# EAGLE design s2k_kpro (EAGLE 7.6.0)

## Sheet 1 of 2: Processor and Digital Interfaces
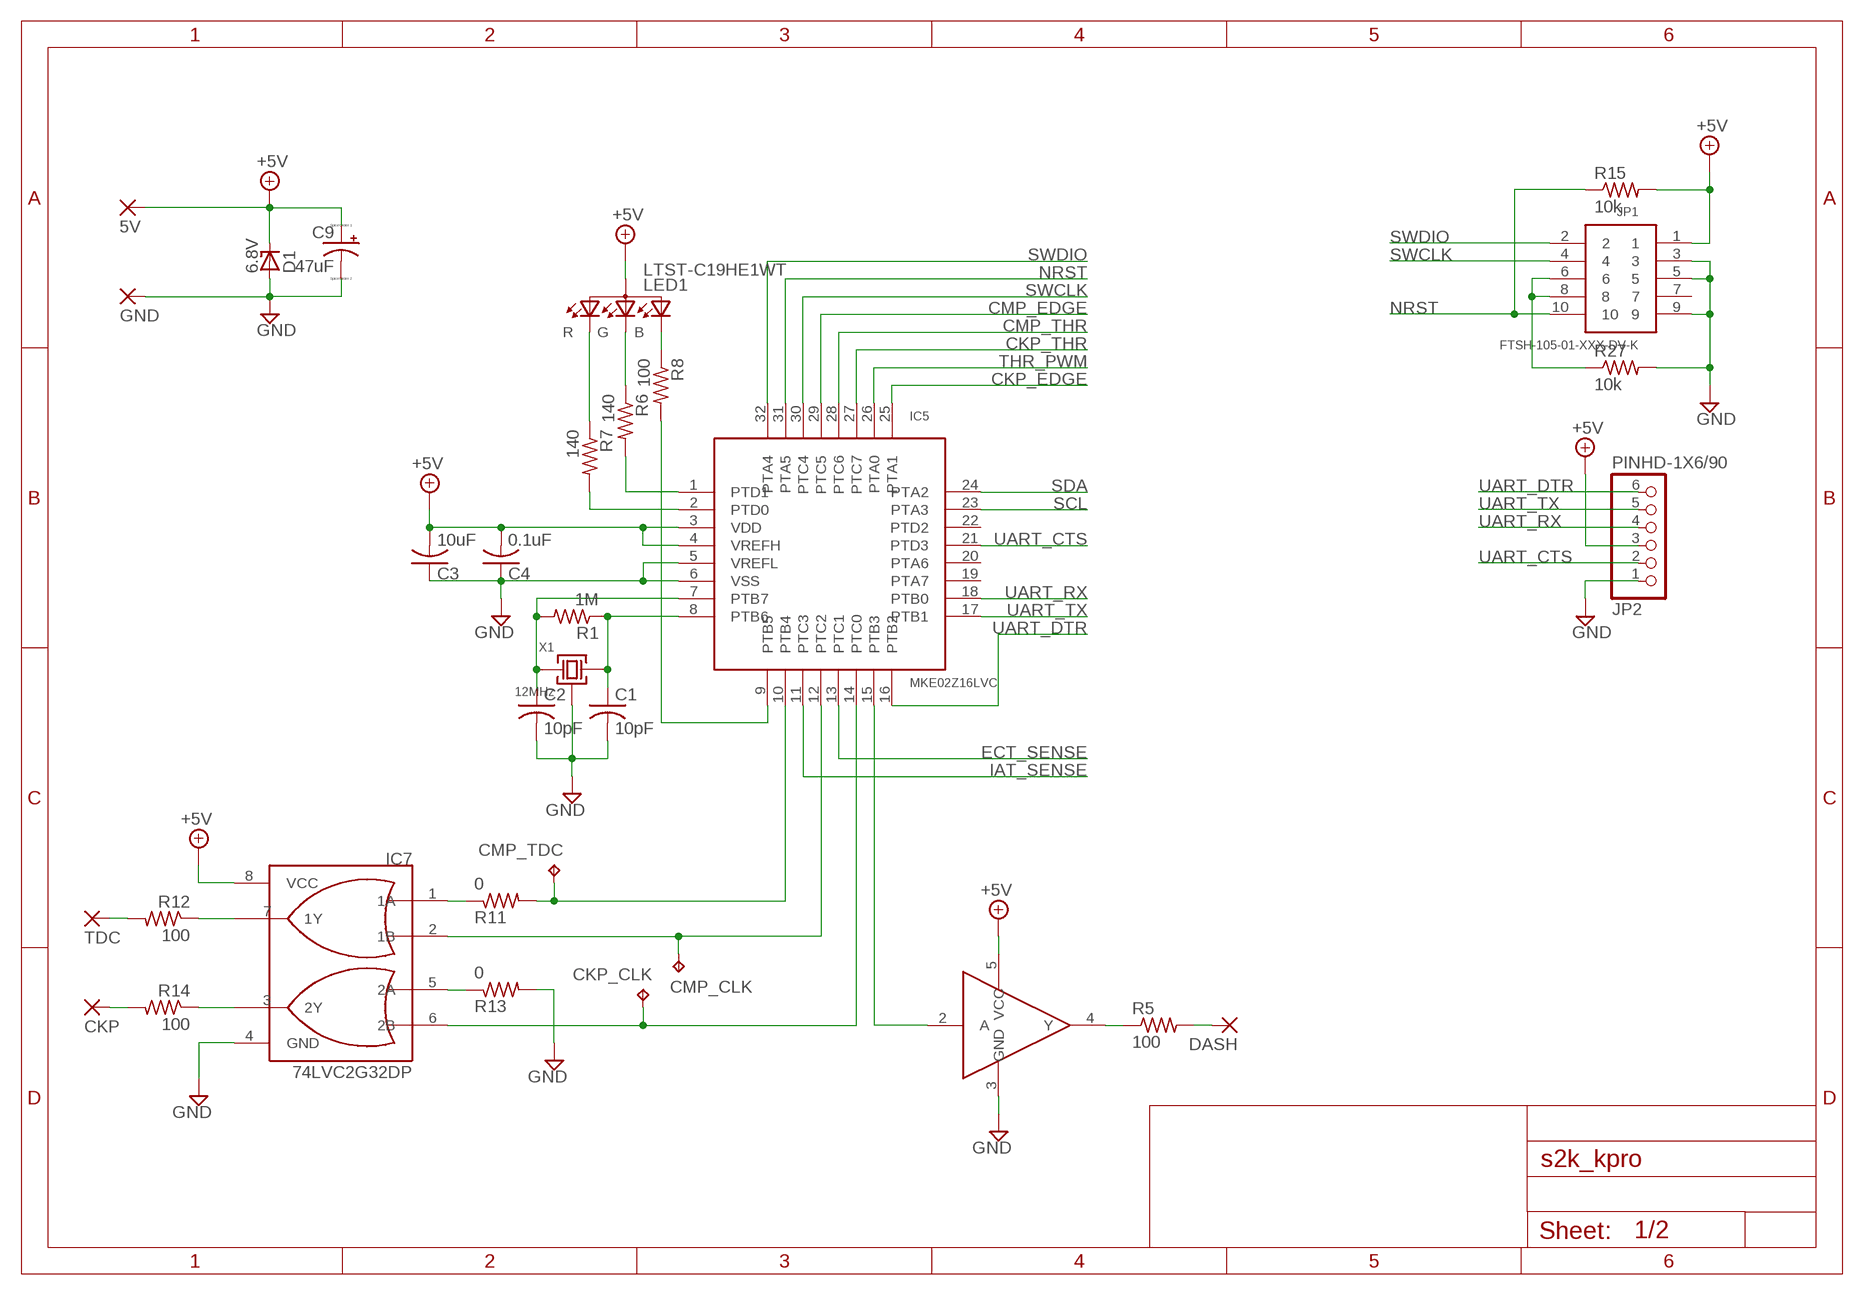
[diagram p0: schematic, sheet 1]

### Parts
5V  5V  SIGPAD-P1-20  [P1-20]
C1  10pF  C-USC0603  [C0603]
C2  10pF  C-USC0603  [C0603]
C3  10uF  C-USC0805  [C0805]
C4  0.1uF  C-USC0603  [C0603]
C9  47uF  CPOL-USD/7343-31R  [D/7343-31R]
CKP  SIGPAD-P1-20  [P1-20]
CKP_CLK  TPB2,54  [B2,54]
CMP_CLK  TPB2,54  [B2,54]
CMP_TDC  TPB2,54  [B2,54]
D1  6.8V  ZENER-DIODESOT23  [SOT23]
DASH  SIGPAD-P1-20  [P1-20]
GND  SIGPAD-P1-20  [P1-20]
IC5  MKE02Z16LVC  [LQFP32-7X7]
IC6  74LVC1G17SE  [SOT353]
IC7  74LVC2G32DP  [TSSOP8]
JP1  FTSH-105-01-XXX-DV-K  [FTSH-105-01-XXX-DV-K]
JP2  PINHD-1X6/90  [1X06/90]
LED1  LTST-C19HE1WT  [LED-0606]
R1  1M  R-US_R0603  [R0603]
R5  100  R-US_R0603  [R0603]
R6  140  R-US_R0603  [R0603]
R7  140  R-US_R0603  [R0603]
R8  100  R-US_R0603  [R0603]
R11  0  R-US_R0603  [R0603]
R12  100  R-US_R0603  [R0603]
R13  0  R-US_R0603  [R0603]
R14  100  R-US_R0603  [R0603]
R15  10k  R-US_R0603  [R0603]
R27  10k  R-US_R0603  [R0603]
TDC  SIGPAD-P1-20  [P1-20]
X1  12MHz  CX2520DB  [SMD4-2520]

### Nets
+5V: 5V.TP(P) C3.2 C4.2 C9.+ D1.3(C) IC5.3(VDD) IC5.4(VREFH) IC6.5(VCC) IC7.8(VCC) JP1.1 JP2.3 LED1.4(ANODE) R15.2 ; also sheet 2
CAM_CLK: CMP_CLK.TP IC5.12(PTC2) IC7.2(1B)
CAM_OUT: R12.2 TDC.TP(P)
CAM_TDC: CMP_TDC.TP IC5.10(PTB4) R11.2
CKP_CLK: CKP_CLK.TP IC5.14(PTC0) IC7.6(2B)
CKP_EDGE: IC5.25(PTA1) ; also sheet 2
CKP_THR: IC5.27(PTC7) ; also sheet 2
CMP_EDGE: IC5.29(PTC5) ; also sheet 2
CMP_THR: IC5.28(PTC6) ; also sheet 2
CRANK_OUT: CKP.TP(P) R14.2
ECT_OUT: DASH.TP(P) R5.2
ECT_PWM: IC5.15(PTB3) IC6.2(A)
ECT_SENSE: IC5.13(PTC1) ; also sheet 2
EXTAL: C2.1 IC5.7(PTB7) R1.2 X1.3
GND: C1.2 C2.2 C3.1 C4.1 C9.- D1.1(A) GND.TP(P) IC5.5(VREFL) IC5.6(VSS) IC6.3(GND) IC7.4(GND) JP1.3 JP1.5 JP1.9 JP2.1 R13.2 R27.2 X1.2(GND) X1.4(GND) ; also sheet 2
IAT_SENSE: IC5.11(PTC3) ; also sheet 2
LED_B: IC5.9(PTB5) R8.2
LED_G: IC5.2(PTD0) R7.2
LED_R: IC5.1(PTD1) R6.2
N$1: IC7.7(1Y) R12.1
N$6: IC7.1(1A) R11.1
N$9: LED1.2(G) R6.1
N$11: IC7.5(2A) R13.1
N$12: LED1.1(R) R7.1
N$13: LED1.3(B) R8.1
N$14: IC7.3(2Y) R14.1
N$16: IC6.4(Y) R5.1
N$24: JP1.6 JP1.8 R27.1
NRST: IC5.31(PTA5) JP1.10 R15.1 ; also sheet 2
SCL: IC5.23(PTA3) ; also sheet 2
SDA: IC5.24(PTA2) ; also sheet 2
SWCLK: IC5.30(PTC4) JP1.4
SWDIO: IC5.32(PTA4) JP1.2
THR_PWM: IC5.26(PTA0) ; also sheet 2
UART_CTS: IC5.21(PTD3) JP2.2
UART_DTR: IC5.16(PTB2) JP2.6
UART_RX: IC5.18(PTB0) JP2.4
UART_TX: IC5.17(PTB1) JP2.5
XTAL: C1.1 IC5.8(PTB6) R1.1 X1.1
Unconnected: IC5.19(PTA7) IC5.20(PTA6) IC5.22(PTD2) JP1.7

## Sheet 2 of 2: Analog Interfaces
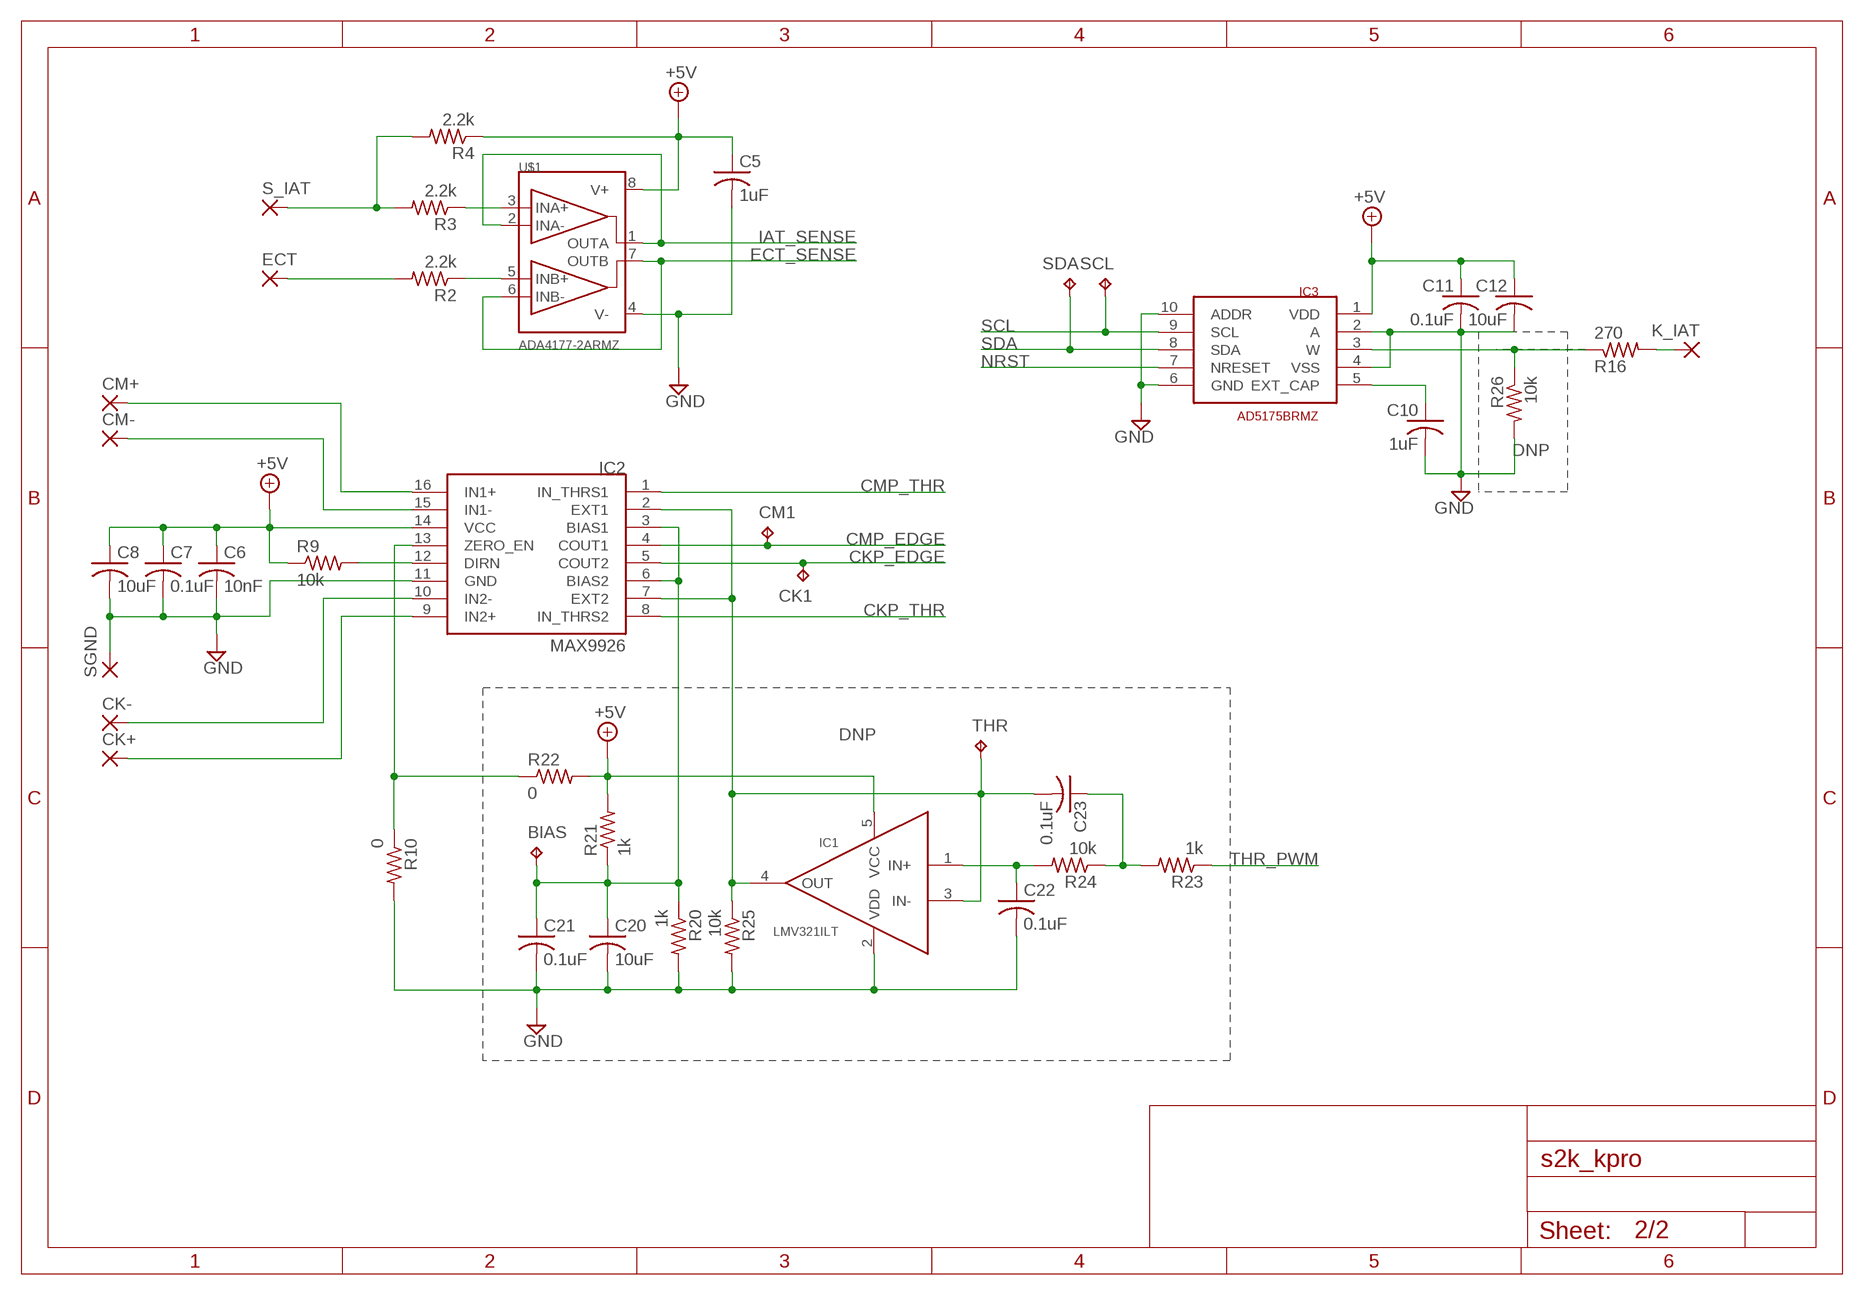
[diagram p1: schematic, sheet 2]

### Parts
BIAS  TPB2,54  [B2,54]
C5  1uF  C-USC0603  [C0603]
C6  10nF  CAP-0306  [C0306]
C7  0.1uF  C-USC0603  [C0603]
C8  10uF  C-USC0805  [C0805]
C10  1uF  C-USC0603  [C0603]
C11  0.1uF  C-USC0603  [C0603]
C12  10uF  C-USC0805  [C0805]
C20  10uF  C-USC0603  [C0603]
C21  0.1uF  C-USC0603  [C0603]
C22  0.1uF  C-USC0603  [C0603]
C23  0.1uF  C-USC0603  [C0603]
CK1  TPB2,54  [B2,54]
CK+  SIGPAD-P1-20  [P1-20]
CK-  SIGPAD-P1-20  [P1-20]
CM1  TPB2,54  [B2,54]
CM+  SIGPAD-P1-20  [P1-20]
CM-  SIGPAD-P1-20  [P1-20]
ECT  SIGPAD-P1-20  [P1-20]
IC1  LMV321ILT  [SOT23-5L]
IC2  MAX9926  [16-QSOP]
IC3  AD5175BRMZ  [MSOP10]
K_IAT  SIGPAD-P1-20  [P1-20]
R2  2.2k  R-US_R0603  [R0603]
R3  2.2k  R-US_R0603  [R0603]
R4  2.2k  R-US_R0603  [R0603]
R9  10k  R-US_R0603  [R0603]
R10  0  R-US_R0603  [R0603]
R16  270  R-US_R0603  [R0603]
R20  1k  R-US_R0603  [R0603]
R21  1k  R-US_R0603  [R0603]
R22  0  R-US_R0603  [R0603]
R23  1k  R-US_R0603  [R0603]
R24  10k  R-US_R0603  [R0603]
R25  10k  R-US_R0603  [R0603]
R26  10k  R-US_R0603  [R0603]
S_IAT  SIGPAD-P1-20  [P1-20]
SCL  TPB2,54  [B2,54]
SDA  TPB2,54  [B2,54]
SGND  SIGPAD-P1-20  [P1-20]
THR  TPB2,54  [B2,54]
U$1  ADA4177-2ARMZ  [MSOP08]

### Nets
+5V: C5.1 C6.1 C7.1 C8.1 C11.1 C12.1 IC1.5(VCC) IC2.14(VCC) IC3.1(VDD) R4.1 R9.1 R21.2 R22.2 U$1.8(V+) ; also sheet 1
CAM_IN+: CM+.TP(P) IC2.16(IN1+)
CAM_IN-: CM-.TP(P) IC2.15(IN1-)
CKP_EDGE: CK1.TP IC2.5(COUT2) ; also sheet 1
CKP_THR: IC2.8(IN_THRS2) ; also sheet 1
CMP_EDGE: CM1.TP IC2.4(COUT1) ; also sheet 1
CMP_THR: IC2.1(IN_THRS1) ; also sheet 1
CRANK_IN+: CK+.TP(P) IC2.9(IN2+)
CRANK_IN-: CK-.TP(P) IC2.10(IN2-)
ECT_SENSE: U$1.6(INB-) U$1.7(OUTB) ; also sheet 1
GND: C5.2 C6.2 C7.2 C8.2 C10.2 C11.2 C12.2 C20.2 C21.2 C22.2 IC1.2(VDD) IC2.11(GND) IC3.2(A) IC3.4(VSS) IC3.6(GND) IC3.10(ADDR) R10.2 R20.2 R25.2 R26.2 SGND.TP(P) U$1.4(V-) ; also sheet 1
IAT_SENSE: U$1.1(OUTA) U$1.2(INA-) ; also sheet 1
N$2: R3.1 U$1.3(INA+)
N$3: R3.2 R4.2 S_IAT.TP(P)
N$4: R2.1 U$1.5(INB+)
N$5: IC2.12(DIRN) R9.2
N$7: ECT.TP(P) R2.2
N$8: C22.1 IC1.1(IN+) R24.2
N$10: IC2.13(ZERO_EN) R10.1 R22.1
N$15: C23.1 R23.2 R24.1
N$18: C23.2 IC1.3(IN-) IC1.4(OUT) IC2.2(EXT1) IC2.7(EXT2) R25.1 THR.TP
N$27: C10.1 IC3.5(EXT_CAP)
N$28: IC3.3(W) R16.1 R26.1
N$29: K_IAT.TP(P) R16.2
NRST: IC3.7(NRESET) ; also sheet 1
SCL: IC3.9(SCL) SCL.TP ; also sheet 1
SDA: IC3.8(SDA) SDA.TP ; also sheet 1
THR_PWM: R23.1 ; also sheet 1
VR_BIAS: BIAS.TP C20.1 C21.1 IC2.3(BIAS1) IC2.6(BIAS2) R20.1 R21.1

### Notes on the sheet
- DNP
- DNP

## Library data of the parts
5V CK+ CK- CKP CM+ CM- DASH ECT GND K_IAT S_IAT SGND TDC = parts:SIGPAD-P1-20: THROUGH-HOLE PAD
BIAS CK1 CKP_CLK CM1 CMP_CLK CMP_TDC SCL SDA THR = testpad:TP: Test pad
C1-C5 C7 C8 C10-C12 C22 C23 = resistor:C-US: CAPACITOR, American symbol
C6 = parts:CAP-0306
C9 = resistor:CPOL-US: POLARIZED CAPACITOR, American symbol
C20 C21 = resistor:C-US: CAPACITOR, American symbol; DNP: DNP
D1 = diode:ZENER-DIODE: Z-Diode
IC1 = parts:LMV321ILT
IC2 = parts:MAX9926
IC3 = parts:AD5175BRMZ
IC5 = parts:MKE02Z16LVC
IC6 = parts:74LVC1G17SE
IC7 = parts:74LVC2G32DP
JP1 = FTSH-105-XX-XX-DV-K:FTSH-105-01-XXX-DV-K
JP2 = parts:PINHD-1X6: PIN HEADER
LED1 = parts:LTST-C19HE1WT
R1-R16 R23 R24 R27 = resistor:R-US_: RESISTOR, American symbol
R20-R22 R25 R26 = resistor:R-US_: RESISTOR, American symbol; DNP: DNP
U$1 = parts:ADA4177-2ARMZ
X1 = parts:CX2520DB

## Board
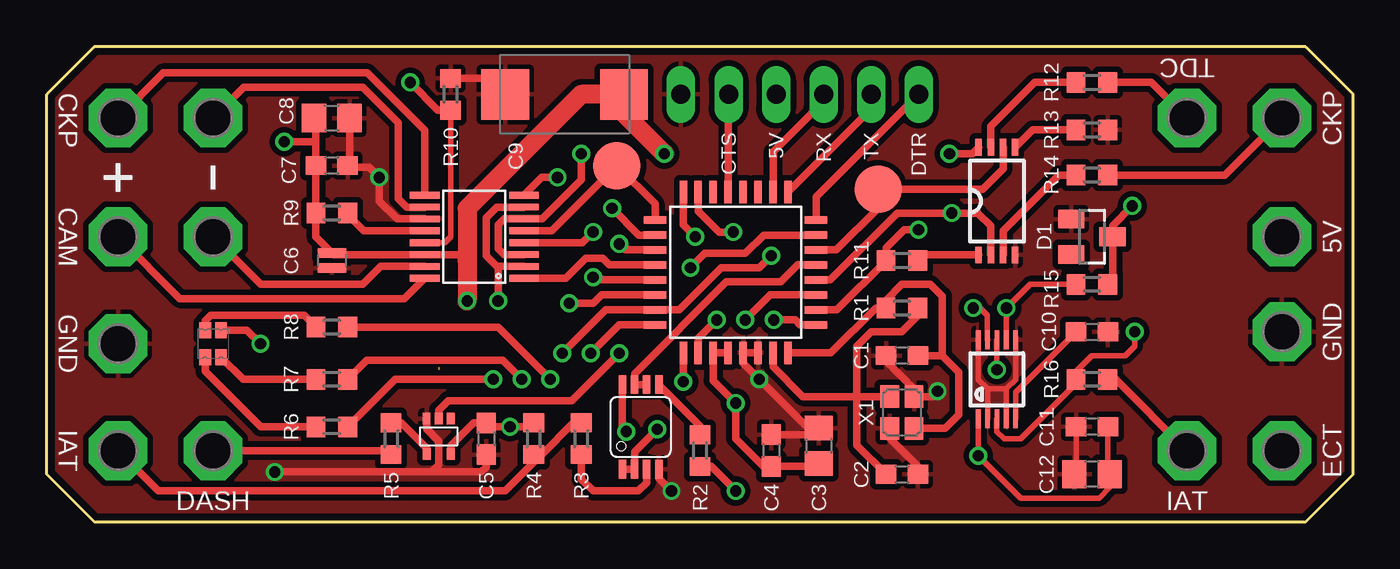
[diagram p2: board, top side]
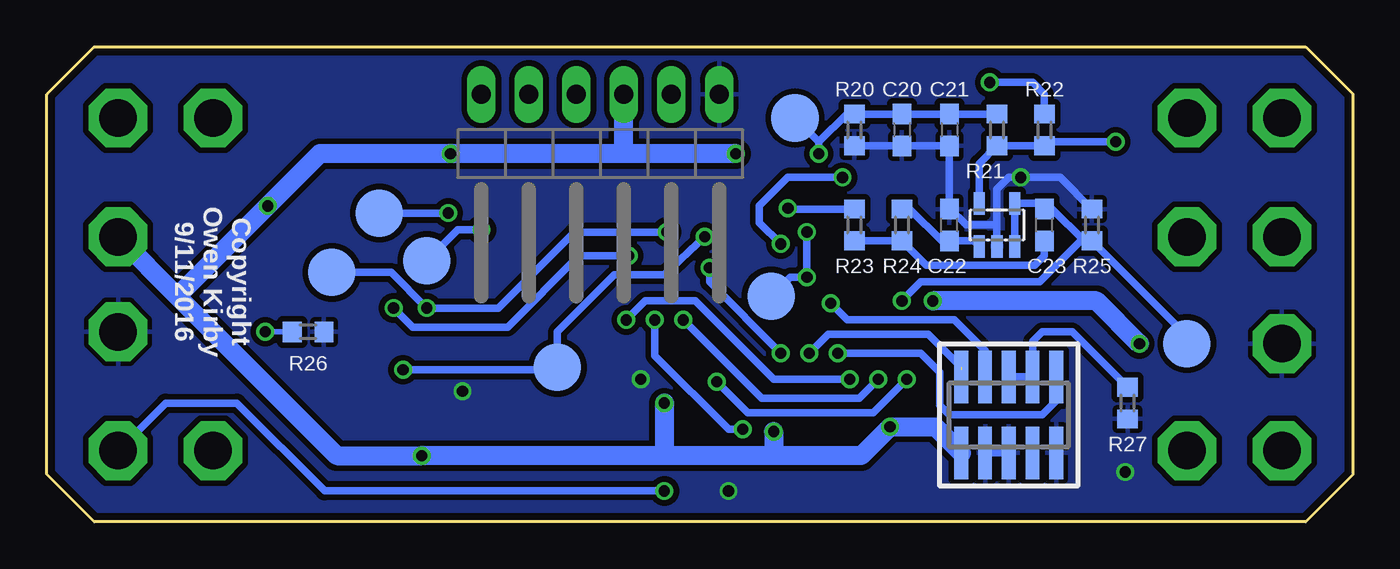
[diagram p3: board, bottom side, seen from below]

Size 69.85 x 25.4 mm. Coordinates in mm from the lower left corner, seen from the top.
Outline: 2.54,0 67.31,0 69.85,2.54 69.85,22.86 67.31,25.4 2.54,25.4 0,22.86 0,2.54 2.54,0
Copper layers (1*16): Top 0.0356mm / dielectric 1.5011mm / Bottom 0.0356mm
Design rules "oshpark-2layer": minimum track width 6mil, minimum drill 13mil, track to track 6mil, track to pad 6mil, pad to pad 6mil, via to via 6mil, smd to smd 6mil, copper to edge 15mil, drill to drill 6mil, minimum pad ring 7mil, minimum via ring 7mil, stop-mask expansion 2.5mil, vias tented up to drill 0mil, thermal gap 10mil

### Footprints (pad centres in the part's own frame; a part is rotated, then mirrored left to right if it is on the bottom)
P1-20 = drill 2.007 pad 3.15 octagon: TP 0,0
B2,54 = smd 2.54 x 2.54: TP 0,0
C0603 = smd 1.1 x 1: 1 -0.85,0; 2 0.85,0
C0805 = smd 1.3 x 1.5: 1 -0.95,0; 2 0.95,0
C0306 = smd 1.52 x 0.51: 1 0,0.41; 2 0,-0.41
D/7343-31R = smd 2.55 x 2.7: + 3.175,0; - -3.175,0
SOT23 = smd 1 x 1.4: 1 -0.95,-1.1; 2 0.95,-1.1; 3 0,1.1
SOT23-5L = smd 0.6 x 1.2: 1 -0.95,-1.15; 2 0,-1.15; 3 0.95,-1.15; 4 0.95,1.15; 5 -0.95,1.15
16-QSOP = smd 1.6 x 0.36: 1 -2.655,2.223; 2 -2.655,1.587; 3 -2.655,0.953; 4 -2.655,0.318; 5 -2.655,-0.318; 6 -2.655,-0.953; 7 -2.655,-1.587; 8 -2.655,-2.223; 9 2.655,-2.223; 10 2.655,-1.587; 11 2.655,-0.953; 12 2.655,-0.318; 13 2.655,0.318; 14 2.655,0.953; 15 2.655,1.587; 16 2.655,2.223
MSOP10 = smd 0.25 x 1: 1 -1,-2.113; 2 -0.5,-2.113; 3 0,-2.113; 4 0.5,-2.113; 5 1,-2.113; 6 1,2.113; 7 0.5,2.113; 8 0,2.113; 9 -0.5,2.113; 10 -1,2.113
LQFP32-7X7 = smd 1.2 x 0.4: 1 -4.3,2.8; 2 -4.3,2; 3 -4.3,1.2; 4 -4.3,0.4; 5 -4.3,-0.4; 6 -4.3,-1.2; 7 -4.3,-2; 8 -4.3,-2.8; 17 4.3,-2.8; 18 4.3,-2; 19 4.3,-1.2; 20 4.3,-0.4; 21 4.3,0.4; 22 4.3,1.2; 23 4.3,2; 24 4.3,2.8 | smd 0.4 x 1.2: 9 -2.8,-4.3; 10 -2,-4.3; 11 -1.2,-4.3; 12 -0.4,-4.3; 13 0.4,-4.3; 14 1.2,-4.3; 15 2,-4.3; 16 2.8,-4.3; 25 2.8,4.3; 26 2,4.3; 27 1.2,4.3; 28 0.4,4.3; 29 -0.4,4.3; 30 -1.2,4.3; 31 -2,4.3; 32 -2.8,4.3
SOT353 = smd 0.42 x 0.6: 1 0.65,0.95; 2 0,0.95; 3 -0.65,0.95; 4 -0.64,-0.95; 5 0.65,-0.95
TSSOP8 = smd 0.9 x 0.35: 1 -2.875,0.975; 2 -2.875,0.325; 3 -2.875,-0.325; 4 -2.875,-0.975; 5 2.875,-0.975; 6 2.875,-0.325; 7 2.875,0.325; 8 2.875,0.975
FTSH-105-01-XXX-DV-K = smd 0.737 x 2.794: 1 -2.54,-2.032; 2 -2.54,2.032; 3 -1.27,-2.032; 4 -1.27,2.032; 5 0,-2.032; 6 0,2.032; 7 1.27,-2.032; 8 1.27,2.032; 9 2.54,-2.032; 10 2.54,2.032
1X06/90 = drill 1.016 long: 1 -6.35,-3.81; 2 -3.81,-3.81; 3 -1.27,-3.81; 4 1.27,-3.81; 5 3.81,-3.81; 6 6.35,-3.81
LED-0606 = smd 0.635 x 0.85: 1 -0.425,0.725; 2 0.425,0.725; 3 0.425,-0.725; 4 -0.425,-0.725
R0603 = smd 1 x 1.1: 1 -0.85,0; 2 0.85,0
MSOP08 = smd 0.4 x 1: 1 -0.976,-2.263; 2 -0.326,-2.263; 3 0.324,-2.263; 4 0.974,-2.263; 5 0.974,2.262; 6 0.324,2.262; 7 -0.326,2.262; 8 -0.976,2.262
SMD4-2520 = smd 1.2 x 1: 1 -0.85,-0.65; 2 0.85,-0.65; 3 0.85,0.65; 4 -0.85,0.65

### Placement (x,y rotation side)
5V  66.04,15.24 270 top
BIAS  29.84,21.59 0 bottom
C1  45.72,8.89 180 top
C2  45.72,2.54 0 top
C3  41.27,4.06 270 top
C4  38.73,3.81 270 top
C5  23.5,4.45 270 top
C6  15.24,13.97 0 top
C7  15.24,19.05 0 top
C8  15.24,21.59 0 top
C9  27.69,22.86 0 top
C10  55.88,10.16 0 top
C11  55.88,5.08 180 top
C12  55.88,2.54 180 top
C20  24.13,20.95 270 bottom
C21  21.59,20.95 270 bottom
C22  21.59,15.88 90 bottom
C23  16.51,15.88 90 bottom
CK1  30.48,19.05 0 top
CK+  3.81,21.59 90 top
CK-  8.89,21.59 90 top
CKP  66.04,21.59 270 top
CKP_CLK  44.45,17.78 90 top
CM1  31.11,12.06 0 bottom
CM+  3.81,15.24 90 top
CM-  8.89,15.24 90 top
CMP_CLK  52.07,16.51 0 bottom
CMP_TDC  49.53,13.97 0 bottom
D1  55.88,15.24 270 top
DASH  8.89,3.81 90 top
ECT  66.04,3.81 0 top
GND  66.04,10.16 270 top
IC1  19.05,15.88 0 bottom
IC2  22.86,15.24 180 top
IC3  50.8,7.62 0 top
IC5  36.83,13.34 90 top
IC6  20.95,4.57 0 top
IC7  50.8,17.14 90 top
JP1  18.41,5.71 0 bottom
JP2  40.26,19.05 180 bottom
K_IAT  60.96,3.81 0 top
LED1  8.89,9.53 180 top
R1  45.72,11.43 0 top
R2  34.92,3.81 270 top
R3  28.57,4.45 90 top
R4  26.04,4.45 270 top
R5  18.41,4.45 270 top
R6  15.24,5.08 0 top
R7  15.24,7.62 0 top
R8  15.24,10.41 0 top
R9  15.24,16.51 0 top
R10  21.59,22.86 90 top
R11  45.72,13.97 180 top
R12  55.88,23.5 0 top
R13  55.88,20.95 0 top
R14  55.88,18.54 0 top
R15  55.88,12.7 0 top
R16  55.88,7.62 0 top
R20  26.67,20.95 270 bottom
R21  19.05,20.95 270 bottom
R22  16.51,20.95 270 bottom
R23  26.67,15.88 270 bottom
R24  24.13,15.88 90 bottom
R25  13.97,15.88 90 bottom
R26  55.88,10.16 0 bottom
R27  12.06,6.35 270 bottom
S_IAT  3.81,3.81 90 top
SCL  54.61,13.34 180 bottom
SDA  42.55,8.26 0 bottom
SGND  3.81,9.53 0 top
TDC  60.96,21.59 270 top
THR  8.89,9.53 0 bottom
U$1  31.75,5.08 0 top
X1  45.72,5.84 90 top

### Tracks (layer width: path | path; a pad name or v marks a point on that pad's centre or on a via)
+5V  (via drill 0.6)
  Top 0.305: IC3.1 v49.8,3.54 52.07,1.27 56.26,1.27 56.83,1.84 C12.1 56.73,2.64 C11.1
  Top 0.406: C3.2 41.17,2.96 C4.2 38.31,2.96 36.83,4.45 v36.83,6.35 35.63,7.55 IC5.3 IC5.4 | R15.2 56.98,12.95 D1.3 56.98,15.83 v58.04,16.89 | IC7.8 49.49,19.68 v48.26,19.68 | C8.1 14.39,21.49 14.39,20.19 | 14.39,20.19 C7.1 R9.1 14.39,15.23 C6.1 15.33,14.29 IC2.14 22.16,14.29 22.48,13.97 | R4.1 25.61,5.08 v24.77,5.08 23.71,5.08 C5.1 22.82,5.29 21.61,4.08 IC6.5 | U$1.8 30.77,5.04 v30.99,4.83 | LED1.4 10.71,10.25 v11.43,9.53 | v12.7,20.32 14.26,20.32 14.39,20.19
  Top 1.016: v33.02,19.68 30.86,21.84 C9.+ 28.57,22.86 22.48,16.76 22.48,13.97 v22.48,11.81
  Bottom 0.406: IC1.5 20,19.16 R21.2 R22.2 16.51,20.32 v12.7,20.32
  Bottom 1.016: 38.99,19.68 JP2.3 | v33.02,19.68 38.99,19.68 | 5V.TP 62.87,12.06 | 62.87,12.06 54.34,3.54 v49.8,3.54 36.83,3.54 | 38.99,19.68 v48.26,19.68 55.24,19.68 v58.04,16.89 62.87,12.06 | v36.83,6.35 36.83,3.54 | v22.48,11.81 13.72,11.81 v11.43,9.53 | 31.11,3.54 26.3,3.54 v24.77,5.08 22.35,5.08 JP1.1 | 31.11,3.54 36.83,3.54 | v30.99,4.83 30.99,3.67 31.11,3.54
CAM_CLK  (via drill 0.6)
  Top 0.406: IC5.12 41.89,12.94 45.47,16.51 v48.39,16.51 49.78,16.51 50.48,15.82 IC7.2
  Bottom 0.406: CMP_CLK.TP v48.39,16.51
CAM_IN+
  Top 0.406: CM+.TP 7.11,11.94 19.12,11.94 IC2.16
CAM_IN-
  Top 0.406: CM-.TP 11.43,12.7 16.89,12.7 17.84,13.65 IC2.15
CAM_OUT
  Top 0.406: R12.2 59.05,23.5 TDC.TP
CAM_TDC  (via drill 0.6)
  Top 0.406: IC5.10 42.23,11.34 R11.2 44.87,14.64 45.85,15.62 v46.61,15.62
  Bottom 0.406: CMP_TDC.TP 47.88,15.62 v46.61,15.62
CKP_CLK
  Top 0.406: IC7.6 51.12,18.87 50.04,17.78 CKP_CLK.TP 44.45,16.76 42.22,14.54 IC5.14
CKP_EDGE
  Top 0.406: 32.12,16.14 IC5.25 32.53,17 CK1.TP 26.99,15.56 IC2.5
CKP_THR  (via drill 0.6)
  Top 0.406: IC5.27 30.93,14.54 v30.61,14.86 | v27.3,18.41 26.47,18.41 IC2.8
  Bottom 0.406: v27.3,18.41 30.23,18.41 31.75,16.89 31.75,16 v30.61,14.86
CMP_EDGE  (via drill 0.6)
  Top 0.406: v29.21,13.08 29.36,12.94 IC5.29 | IC2.4 28.64,14.92 v29.21,15.49
  Bottom 0.406: 31.75,12.7 CM1.TP 30.1,13.08 v29.21,13.08 v29.21,15.49
CMP_THR
  Top 0.406: IC5.28 30.08,13.73 29.72,14.1 28.83,14.1 27.75,13.02 IC2.1
CRANK_IN+
  Top 0.406: IC2.9 20.2,20.94 17.14,24 6.22,24 CK+.TP
CRANK_IN-
  Top 0.406: IC2.10 19.24,16.83 18.8,17.27 18.8,21.34 16.89,23.24 10.54,23.24 CK-.TP
CRANK_OUT
  Top 0.406: R14.2 62.99,18.54 CKP.TP
ECT_OUT
  Top 0.406: R5.2 18.33,3.81 DASH.TP
ECT_PWM  (via drill 0.6)
  Top 0.406: IC6.2 20.95,5.97 21.46,6.48 28.07,6.48 v30.61,9.02 | IC5.15 38.32,15.34 37.34,14.35 35.18,14.35 v34.42,13.59
  Bottom 0.406: v30.61,9.02 34.42,12.83 v34.42,13.59
ECT_SENSE
  Top 0.406: IC5.13 40.15,13.73 39.24,12.83 36.32,12.83 31.42,7.93 U$1.7 U$1.6
EXTAL
  Top 0.406: 38.83,9.43 IC5.7 38.83,8.29 40.42,6.69 43.31,6.69 | C2.1 43.31,4.1 43.31,6.69 | 43.31,6.69 X1.3 | R1.2 46.57,11.01 45.72,10.16 44.07,10.16 43.31,9.4 43.31,6.69
GND  (via drill 0.6)
  Top 0.305: 50.3,7.1 49.8,7.6 IC3.10 | IC3.2 50.3,7.1 | IC3.4 51.3,7.1 | 51.3,7.1 50.3,7.1 | 51.3,7.1 51.8,7.6 IC3.6 51.8,9.89 | C11.2 55.03,2.64 C12.2
  Top 0.406: IC5.6 IC5.5 37.23,8.49 v38.1,7.62 40.64,5.08 40.95,5.08 C3.1 41.17,4.66 C4.1 | 44.98,5.08 44.98,4.55 46.57,2.96 C2.2 | C1.2 44.87,8.6 46.37,7.1 X1.2 47.33,6.69 v47.62,6.99 | C9.- 23.66,23.71 R10.2 | C8.2 16.19,19.05 C7.2 16.09,18.95 17.25,18.95 v17.78,18.41 17.78,17.14 18.73,16.19 IC2.11 | U$1.4 32.72,2.33 v33.4,1.65 | IC6.3 20.3,4.97 20.95,4.32 20.95,3.05 20.57,2.67 | C5.2 23.5,2.92 23.24,2.67 20.57,2.67 | 20.57,2.67 v12.19,2.67
  Bottom 0.406: JP1.3 JP1.5 | 19.05,15.88 20.7,15.88 21.55,16.73 C22.2 C21.2 C20.2 R20.2 | 19.05,15.88 19.05,17.78 18.41,18.41 v17.78,18.41 15.66,18.41 R25.2 | 19.05,15.88 IC1.2
  pour Bottom (isolate 0.305): 2.54,25.4 67.31,25.4 69.85,22.86 69.85,2.54 67.31,0 2.54,0 0,2.54 0,22.86
  pour Top (isolate 0.305): 2.54,25.4 67.31,25.4 69.85,22.86 69.85,2.54 67.31,0 2.54,0 0,2.54 0,22.86
IAT_SENSE  (via drill 0.6)
  Top 0.406: IC5.11 38.68,12.13 v37.34,10.79 | v32.64,4.95 31.42,3.74 U$1.2 U$1.1
  Bottom 0.406: v37.34,10.79 37.34,8.89 33.4,4.95 v32.64,4.95
LED_B  (via drill 0.6)
  Top 0.406: IC5.9 40.27,10.54 40.01,10.79 v38.86,10.79 | R8.2 24.13,10.41 v26.92,7.62
  Bottom 0.406: v38.86,10.79 37.85,11.81 35.18,11.81 30.99,7.62 v26.92,7.62
LED_G  (via drill 0.6)
  Top 0.406: 16.34,7.87 R7.2 17.11,8.64 24.38,8.64 v25.4,7.62 | IC5.2 34.83,9.81 v35.81,10.79
  Bottom 0.406: v35.81,10.79 31.62,6.6 26.42,6.6 v25.4,7.62
LED_R  (via drill 0.6)
  Top 0.406: IC5.1 v34.03,7.5 v34.04,7.49 | R6.2 18.63,7.62 v23.88,7.62
  Bottom 0.406: v34.04,7.49 32.38,5.84 25.65,5.84 v23.88,7.62
N$1
  Top 0.406: R12.1 52.83,23.5 50.48,21.14 IC7.7
N$2
  Top 0.406: R3.1 28.57,2.29 29.21,1.65 31.62,1.65 32.07,2.1 U$1.3
N$3
  Top 0.406: S_IAT.TP 5.97,1.65 24.51,1.65 26.04,3.17 R4.2 26.45,3.6 28.16,5.29 R3.2
N$4
  Top 0.406: U$1.5 34.92,5.14 R2.1
N$5
  Top 0.406: R9.2 16.09,16.42 16.95,15.56 IC2.12
N$6
  Top 0.406: IC7.1 46.87,14.27 R11.1
N$7  (via drill 0.6)
  Top 0.406: R2.2 35.52,2.96 v36.83,1.65
  Bottom 0.406: v36.83,1.65 54.99,1.65 59.69,6.35 63.5,6.35 ECT.TP
N$8
  Bottom 0.406: IC1.1 20.3,15.03 C22.1 22.01,15.03 23.71,16.73 R24.2
N$9
  Top 0.406: LED1.2 8.46,8.04 11.43,5.08 R6.1
N$10  (via drill 0.6)
  Top 0.305: IC2.13 21.27,14.92 21.59,15.24 R10.1
  Top 0.406: R10.1 20.92,22.01 v19.43,23.5
  Bottom 0.406: v19.43,23.5 17.14,23.5 16.51,22.86 R22.1
N$11
  Top 0.406: IC7.5 52.71,20.95 R13.1
N$12
  Top 0.406: R7.1 10.49,7.62 LED1.1
N$13
  Top 0.406: LED1.3 8.46,10.75 8.76,11.05 13.76,11.05 R8.1
N$14
  Top 0.406: IC7.3 51.12,15.56 54.1,18.54 R14.1
N$15
  Bottom 0.406: C23.1 16.51,14.22 17.02,13.72 22.82,13.72 R24.1 | 24.55,15.03 R24.1 | R23.2 R24.1
N$16
  Top 0.406: IC6.4 20.32,3.94 18.96,5.29 R5.1
N$18  (via drill 0.6)
  Top 0.406: IC2.7 24.07,16.83 23.5,16.26 23.5,14.22 24.07,13.65 | IC2.2 24.07,13.65 | 24.07,13.65 24.13,13.59 v24.13,11.81
  Bottom 0.406: IC1.3 IC1.4 16.81,17.02 C23.2 16.09,16.73 14.39,15.03 R25.1 | R25.1 14.57,15.03 16.76,12.83 23.11,12.83 v24.13,11.81 | R25.1 8.89,9.95 THR.TP
N$24
  Bottom 0.406: JP1.6 JP1.8 17.14,9.65 16.64,10.16 15.03,10.16 R27.1
N$27
  Top 0.305: IC3.5 51.8,6.93 C10.1
N$28  (via drill 0.6)
  Top 0.305: IC3.3 50.8,4.83 51.18,4.45 52.07,4.45 55.03,7.41 R16.1 | 55.03,7.53 R16.1 | R16.1 55.03,8.04 55.88,8.89 57.66,8.89 58.17,9.4 v58.17,10.16
  Bottom 0.305: v58.17,10.16 R26.1
N$29
  Top 0.406: K_IAT.TP 57.15,7.62 R16.2
NRST  (via drill 0.6)
  Top 0.305: R15.1 52.58,12.7 v51.31,11.43 IC3.7
  Top 0.406: v27.56,9.02 29.88,11.34 IC5.31 33.81,11.34 36.07,13.59 38.1,13.59 v38.73,14.22
  Bottom 0.406: v51.31,11.43 50.29,10.41 45.21,10.41 41.4,14.22 v38.73,14.22 | JP1.10 15.88,6.48 16.64,5.71 21.59,5.71 22.1,6.22 22.1,8 23.11,9.02 v27.56,9.02
SCL  (via drill 0.6)
  Top 0.305: v49.53,11.43 49.91,11.43 50.29,11.05 IC3.9
  Top 0.406: IC5.23 34.83,16.61 35.94,15.49 v36.7,15.49
  Bottom 0.406: SCL.TP 51.44,13.34 v49.53,11.43 45.72,11.43 41.66,15.49 v36.7,15.49
SDA  (via drill 0.6)
  Top 0.305: v50.8,8.13 IC3.8
  Top 0.406: IC5.24 34.03,15.88 v34.67,15.24
  Bottom 0.406: v50.8,8.13 42.67,8.13 SDA.TP 42.55,10.16 39.5,13.21 36.83,13.21 v34.67,15.24
SWCLK  (via drill 0.6)
  Top 0.406: v27.94,11.68 29.21,11.68 29.66,12.13 IC5.30
  Bottom 0.406: 19.68,8 JP1.4 19.68,9.14 21.34,10.79 27.05,10.79 v27.94,11.68
SWDIO  (via drill 0.6)  (1 unrouted)
  Top 0.406: IC5.32 30.6,10.54 v29.08,9.02
  Bottom 0.406: JP1.2 20.95,8.13 | v29.08,9.02 28.07,10.03 22.73,10.03 20.95,8.26
THR_PWM  (via drill 0.6)
  Top 0.406: IC5.26 31.66,15.34 v30.23,16.76
  Bottom 0.406: R23.1 30.19,16.73 v30.23,16.76
UART_CTS
  Top 0.406: IC5.21 36.43,22.84 JP2.2
UART_DTR
  Top 0.406: IC5.16 41.13,17.38 JP2.6
UART_RX
  Top 0.406: IC5.18 38.83,19.78 41.53,22.48 JP2.4
UART_TX
  Top 0.406: IC5.17 44.07,22.07 JP2.5
VR_BIAS  (via drill 0.6)
  Top 0.406: v28.57,19.68 28.57,18.29 26.48,16.19 IC2.6 24.45,16.19 24.13,15.88 24.13,14.61 24.45,14.29 IC2.3
  Bottom 0.406: R21.1 C21.1 C20.1 R20.1 27.09,21.8 28.57,20.32 | 28.57,20.32 BIAS.TP | v28.57,19.68 28.57,20.32
XTAL
  Top 0.406: C1.1 47.88,8.89 | 47.88,8.89 48.77,8 48.77,5.71 48.05,4.99 X1.1 | IC5.8 41.93,9.04 44.32,11.43 R1.1 44.87,11.85 45.72,12.7 47.24,12.7 47.88,12.06 47.88,8.89

### Text on the board
tPlace: CKP | CTS | 5V | RX | TX | DTR | CAM | GND | IAT | IAT
bPlace: Copyright / Owen Kirby / 9/11/2016
tStop: S2000/K-Pro / Adapter Board / Rev Alpha